# EAGLE design irBoard_mirror (EAGLE 7.6.0)
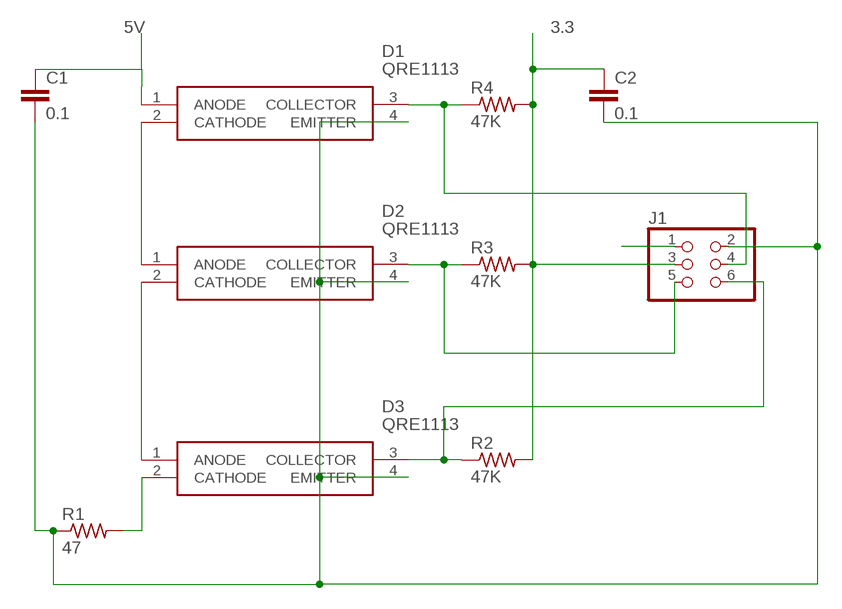
[diagram p0: schematic, sheet 1]

## Parts
C1  0.1  C-EU025-024X044  [C025-024X044]
C2  0.1  C-EU025-024X044  [C025-024X044]
D1  QRE1113  [QRE1113]
D2  QRE1113  [QRE1113]
D3  QRE1113  [QRE1113]
J1  PINHD-2X3  [2X03]
R1  47  R-US_0204/5  [0204/5]
R2  47K  R-US_0204/5  [0204/5]
R3  47K  R-US_0204/5  [0204/5]
R4  47K  R-US_0204/5  [0204/5]

## Nets
3.3: C2.1 J1.3 R2.2 R3.2 R4.2
5V: C1.1 D1.1(ANODE) J1.1
GND: C1.2 C2.2 D1.4(EMITTER) D2.4(EMITTER) D3.4(EMITTER) J1.2 R1.1
N$1: D2.2(CATHODE) D3.1(ANODE)
N$2: D1.2(CATHODE) D2.1(ANODE)
N$4: D3.2(CATHODE) R1.2
N$7: D1.3(COLLECTOR) J1.4 R4.1
N$8: D2.3(COLLECTOR) J1.5 R3.1
N$9: D3.3(COLLECTOR) J1.6 R2.1

## Library data of the parts
C1 C2 = resistor:C-EU: CAPACITOR, European symbol
D1-D3 = QRE1113:QRE1113: Miniature Reflective Object Sensor Fairchild QRE1113, Through Hole Reflective Sensor, Phototransistor Output, Miniature package Source: Datasheet <https://www.fairchildsemi.com/datasheets/QR/QRE1113.pdf>; ARROW_PART_NUMBER: QRE1113; ARROW_PRICE/STOCK: http://uk.rs-online.com/web/p/products/8629400; DESCRIPTION: Miniature Reflective Object Sensor Fairchild QRE1113, Through Hole Reflective Sensor, Phototransistor Output, Miniature package; HEIGHT: mm; MANUFACTURER_NAME: Fairchild Semiconductor; MANUFACTURER_PART_NUMBER: QRE1113; RS_PART_NUMBER: 8629400; RS_PRICE/STOCK: http://uk.rs-online.com/web/p/products/8629400
J1 = SparkFun-Retired:PINHD-2X3: PIN HEADER
R1-R4 = adafruit:R-US_: RESISTOR, American symbol

## Board
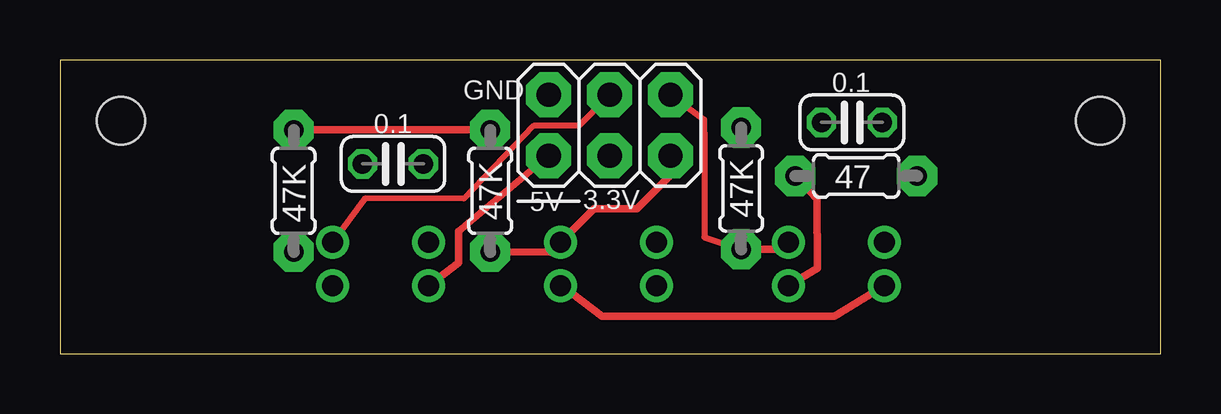
[diagram p1: board, top side]
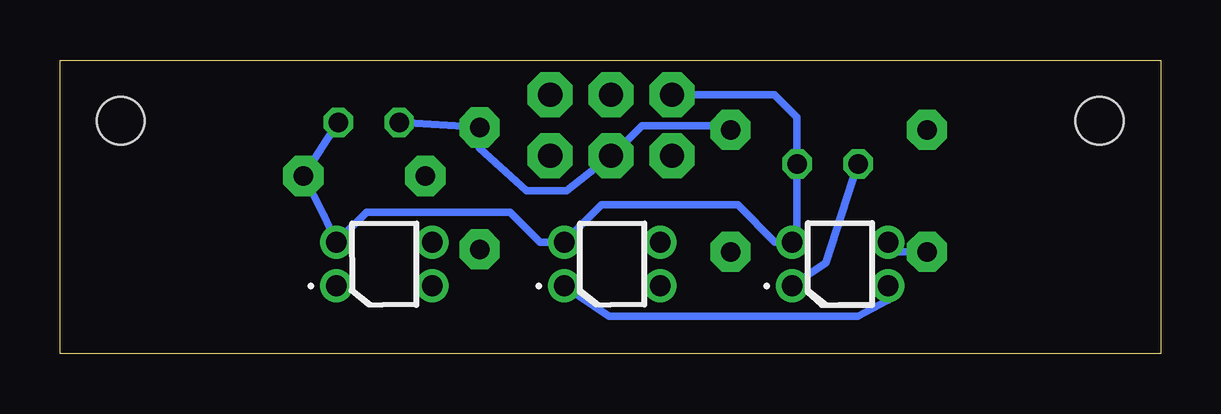
[diagram p2: board, bottom side, seen from below]

Size 45.88 x 12.24 mm. Coordinates in mm from the lower left corner, seen from the top.
Outline: 0,0 45.88,0 45.88,12.24 0,12.24 0,0
Copper layers (1*2*15*16): Top 0.035mm / dielectric 0.2mm / layer 2 0.0175mm / dielectric 1.1mm / layer 15 0.0175mm / dielectric 0.2mm / Bottom 0.035mm
Design rules "SeeedStudio_DRU_no_angle": minimum track width 6mil, minimum drill 12mil, track to track 6mil, track to pad 6mil, pad to pad 6mil, via to via 6mil, smd to smd 0mil, copper to edge 10mil, drill to drill 10mil, minimum pad ring 6mil, minimum via ring 6mil, stop-mask expansion 2mil, vias tented up to drill 25mil, thermal gap 10mil
Holes 2 mm at 2.54,9.71 43.35,9.71

### Footprints (pad centres in the part's own frame; a part is rotated, then mirrored left to right if it is on the bottom)
C025-024X044 = drill 0.813 octagon: 1 -1.27,0; 2 1.27,0
QRE1113 = drill 0.87 pad 1.37: 1 -2,-0.9; 2 2,-0.9; 3 2,0.9; 4 -2,0.9
2X03 = drill 1.016 pad 1.88 octagon: 1 -2.54,-1.27; 2 -2.54,1.27; 3 0,-1.27; 4 0,1.27; 5 2.54,-1.27; 6 2.54,1.27
0204/5 = drill 0.813 pad 1.676 octagon: 1 -2.54,0; 2 2.54,0

### Placement (x,y rotation side)
C1  13.88,7.91 0 top
C2  33.01,9.64 0 top
D1  13.36,3.74 0 bottom
D2  22.86,3.74 0 bottom
D3  32.36,3.74 0 bottom
J1  22.91,9.52 0 top
R1  33.19,7.41 180 top
R2  28.39,6.89 90 top
R3  17.93,6.79 90 top
R4  9.74,6.79 90 top

### Tracks (layer width: path | path; a pad name or v marks a point on that pad's centre or on a via)
3.3
  Top 0.305: R4.2 R3.2 17.96,9.33
  Bottom 0.305: R3.2 18.15,9.5 21.63,9.5 22.88,8.25 J1.3 24.76,6.8 26.43,6.8 28.39,8.56 R2.2 C2.1
5V
  Top 0.305: D1.1 16.62,3.79 16.61,5.11 J1.1
  Bottom 0.305: C1.1 13.96,3.8 D1.1
GND
  Bottom 0.305: J1.2 16.1,10.79 15.17,9.86 15.17,7.61 | 15.17,7.61 15.17,4.83 D1.4 16.07,4.64 17.63,6.2 23.3,6.2 D2.4 25.87,4.64 27.13,5.9 33.1,5.9 D3.4 34.86,5.75 R1.1 C2.2 | C1.2 15.17,7.61
N$1
  Top 0.305: D2.2 20.92,2.84 22.59,1.57 32.29,1.57 D3.1
N$2
  Bottom 0.305: D1.2 11.36,2.24 12.63,1.57 22.99,1.57 D2.1
N$4
  Top 0.305: D3.2 31.58,3.57 31.55,6.45 R1.2
N$7
  Top 0.254: J1.4 21.63,9.5 19.73,9.5 16.84,6.46 12.72,6.47 D1.3
  Bottom 0.305: R4.1 10.97,4.25 D1.3
N$8
  Top 0.305: R3.1 20.46,4.24 D2.3 22.27,6.05 24.06,6.05 25.45,7.44 J1.5
N$9
  Top 0.254: J1.6 26.85,9.76 26.86,8.76 26.86,4.86 R2.1 | 30.07,4.35 D3.3
  Top 0.305: R2.1 30.07,4.35

### Text on the board
tPlace: GND | 5V | 3.3V